# EasyEDA schematic Smart_Tiestu.json

## Sheets
1 Sheet_1: TITLE: Smart Tiestu; REV: 1.0; Date: 2025-11-10; Sheet: 1/1; Drawn By: Diego López; Company: Universidad de Oviedo
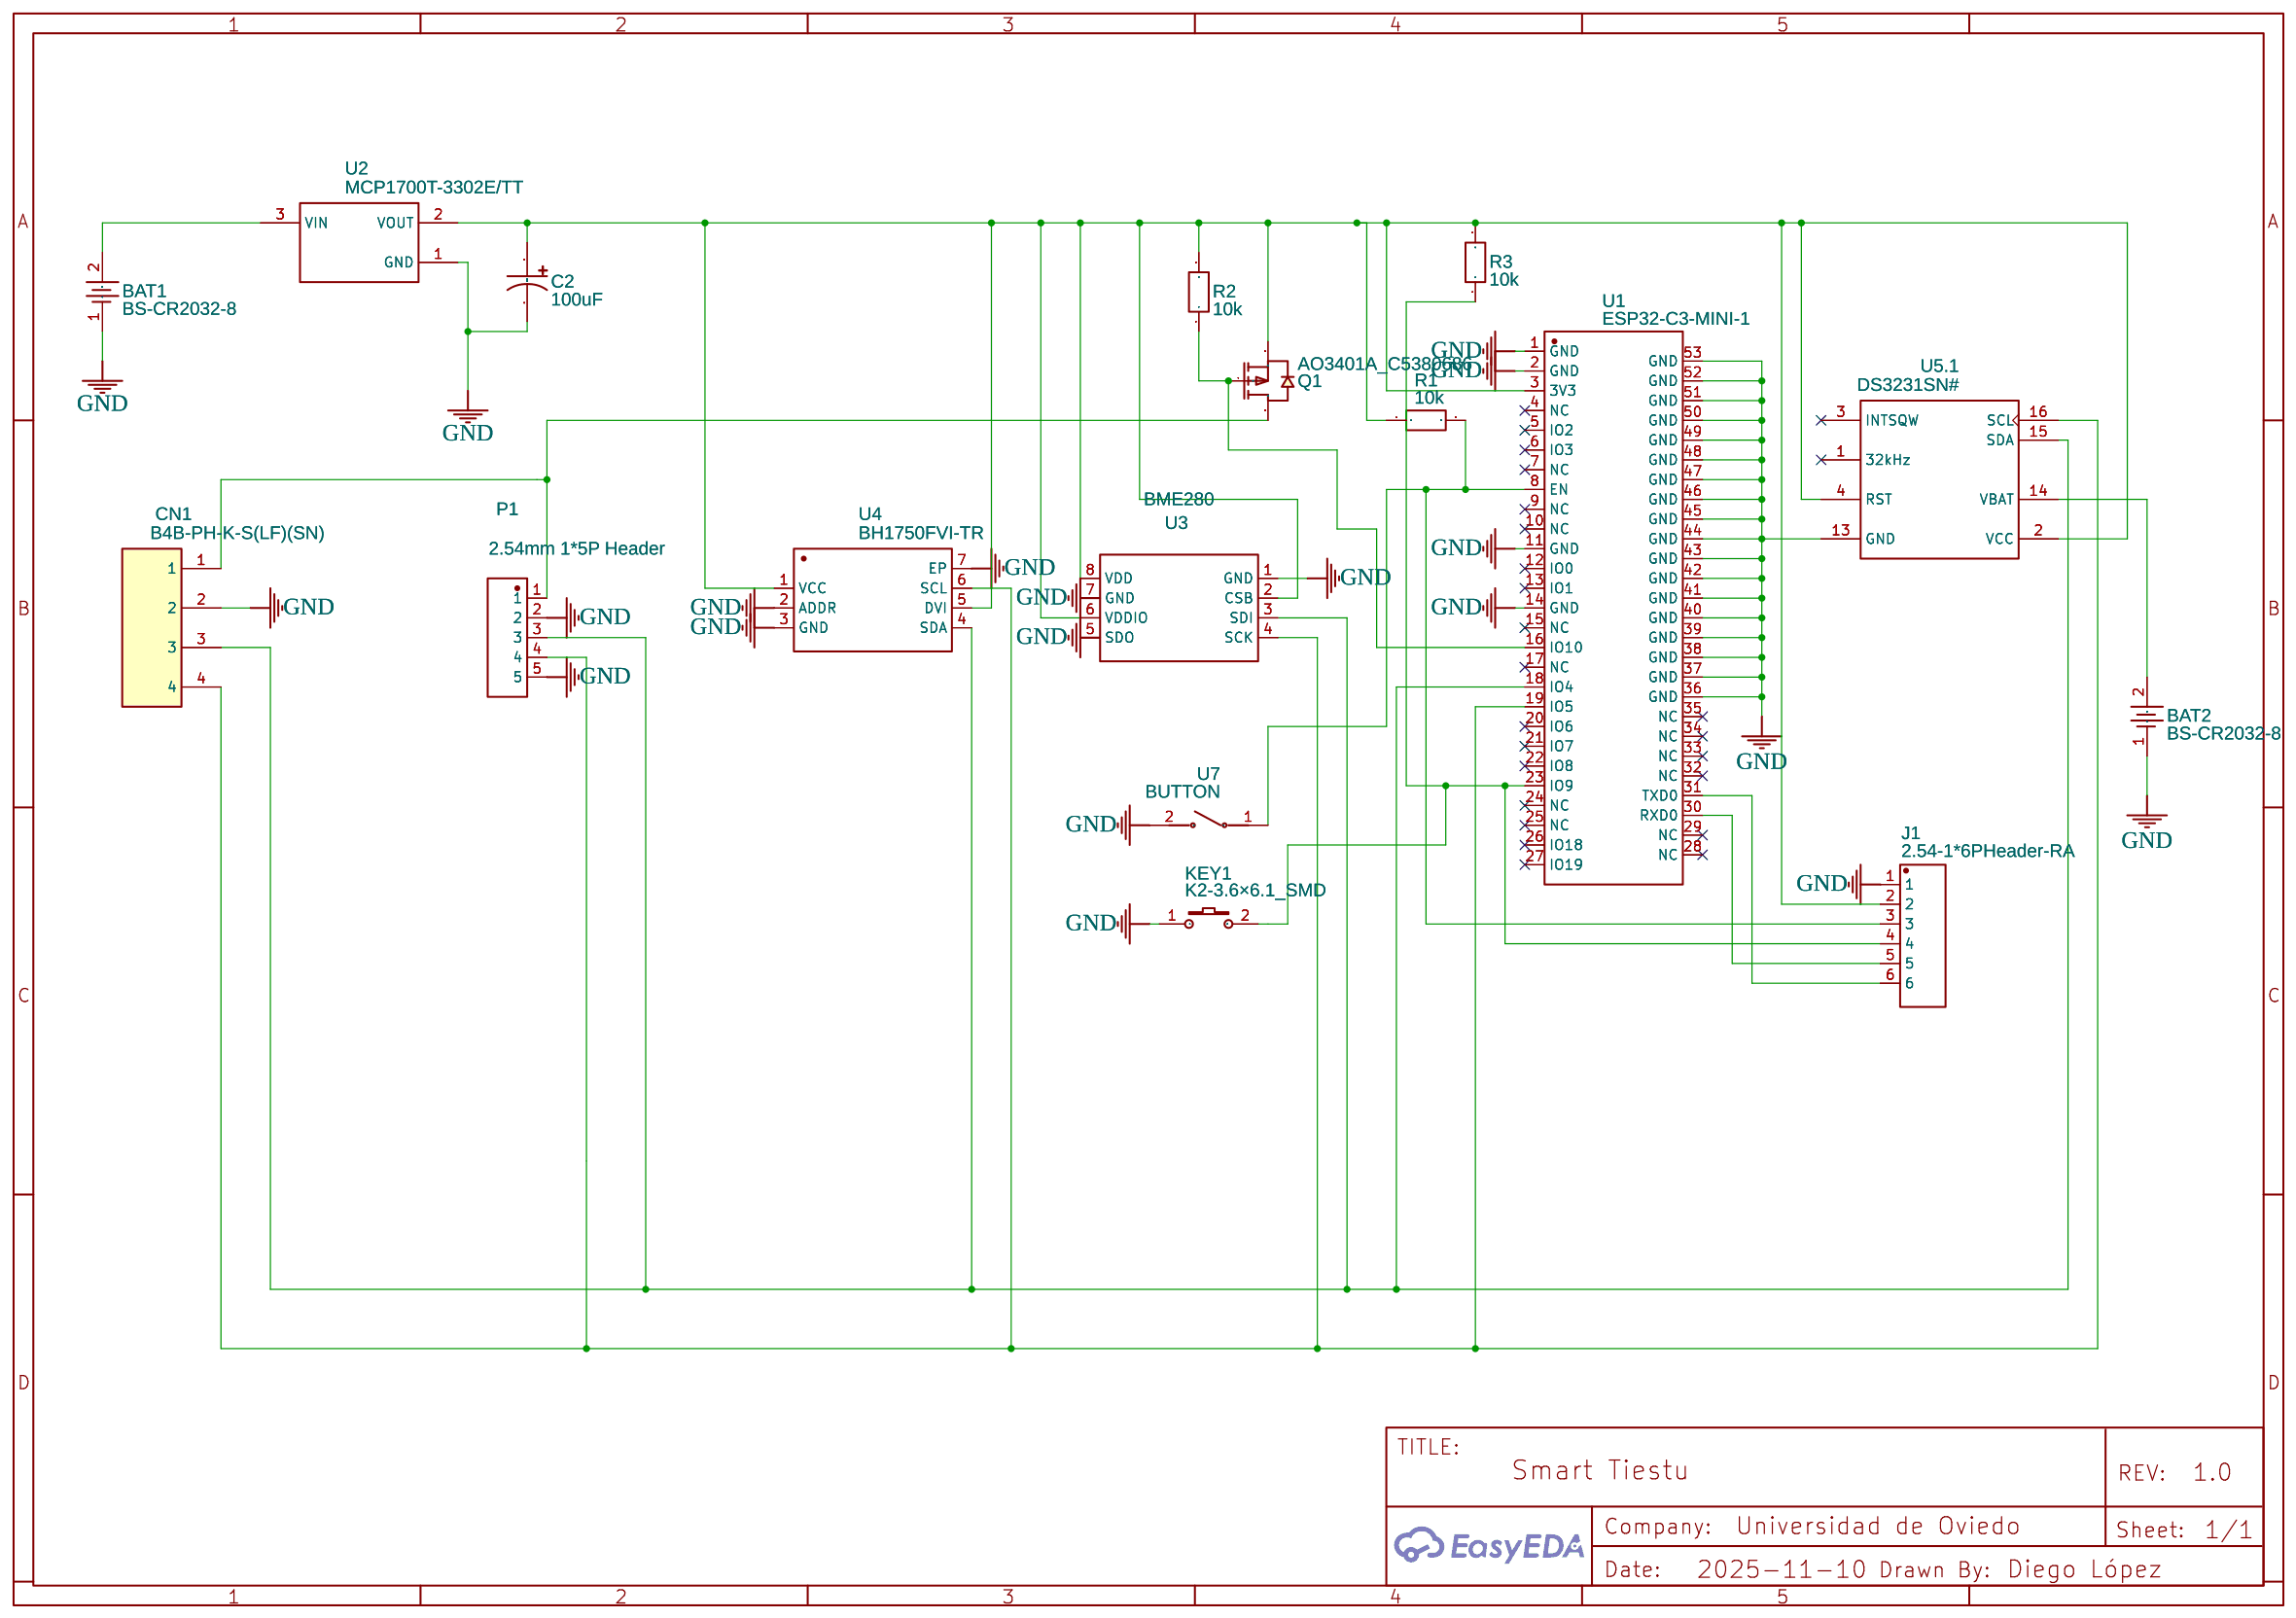
[diagram p0: Sheet_1]
2 Sheet_2: TITLE: Sheet_2; Date: 2025-11-13; Drawn By: lopeznoval; Company: Your Company
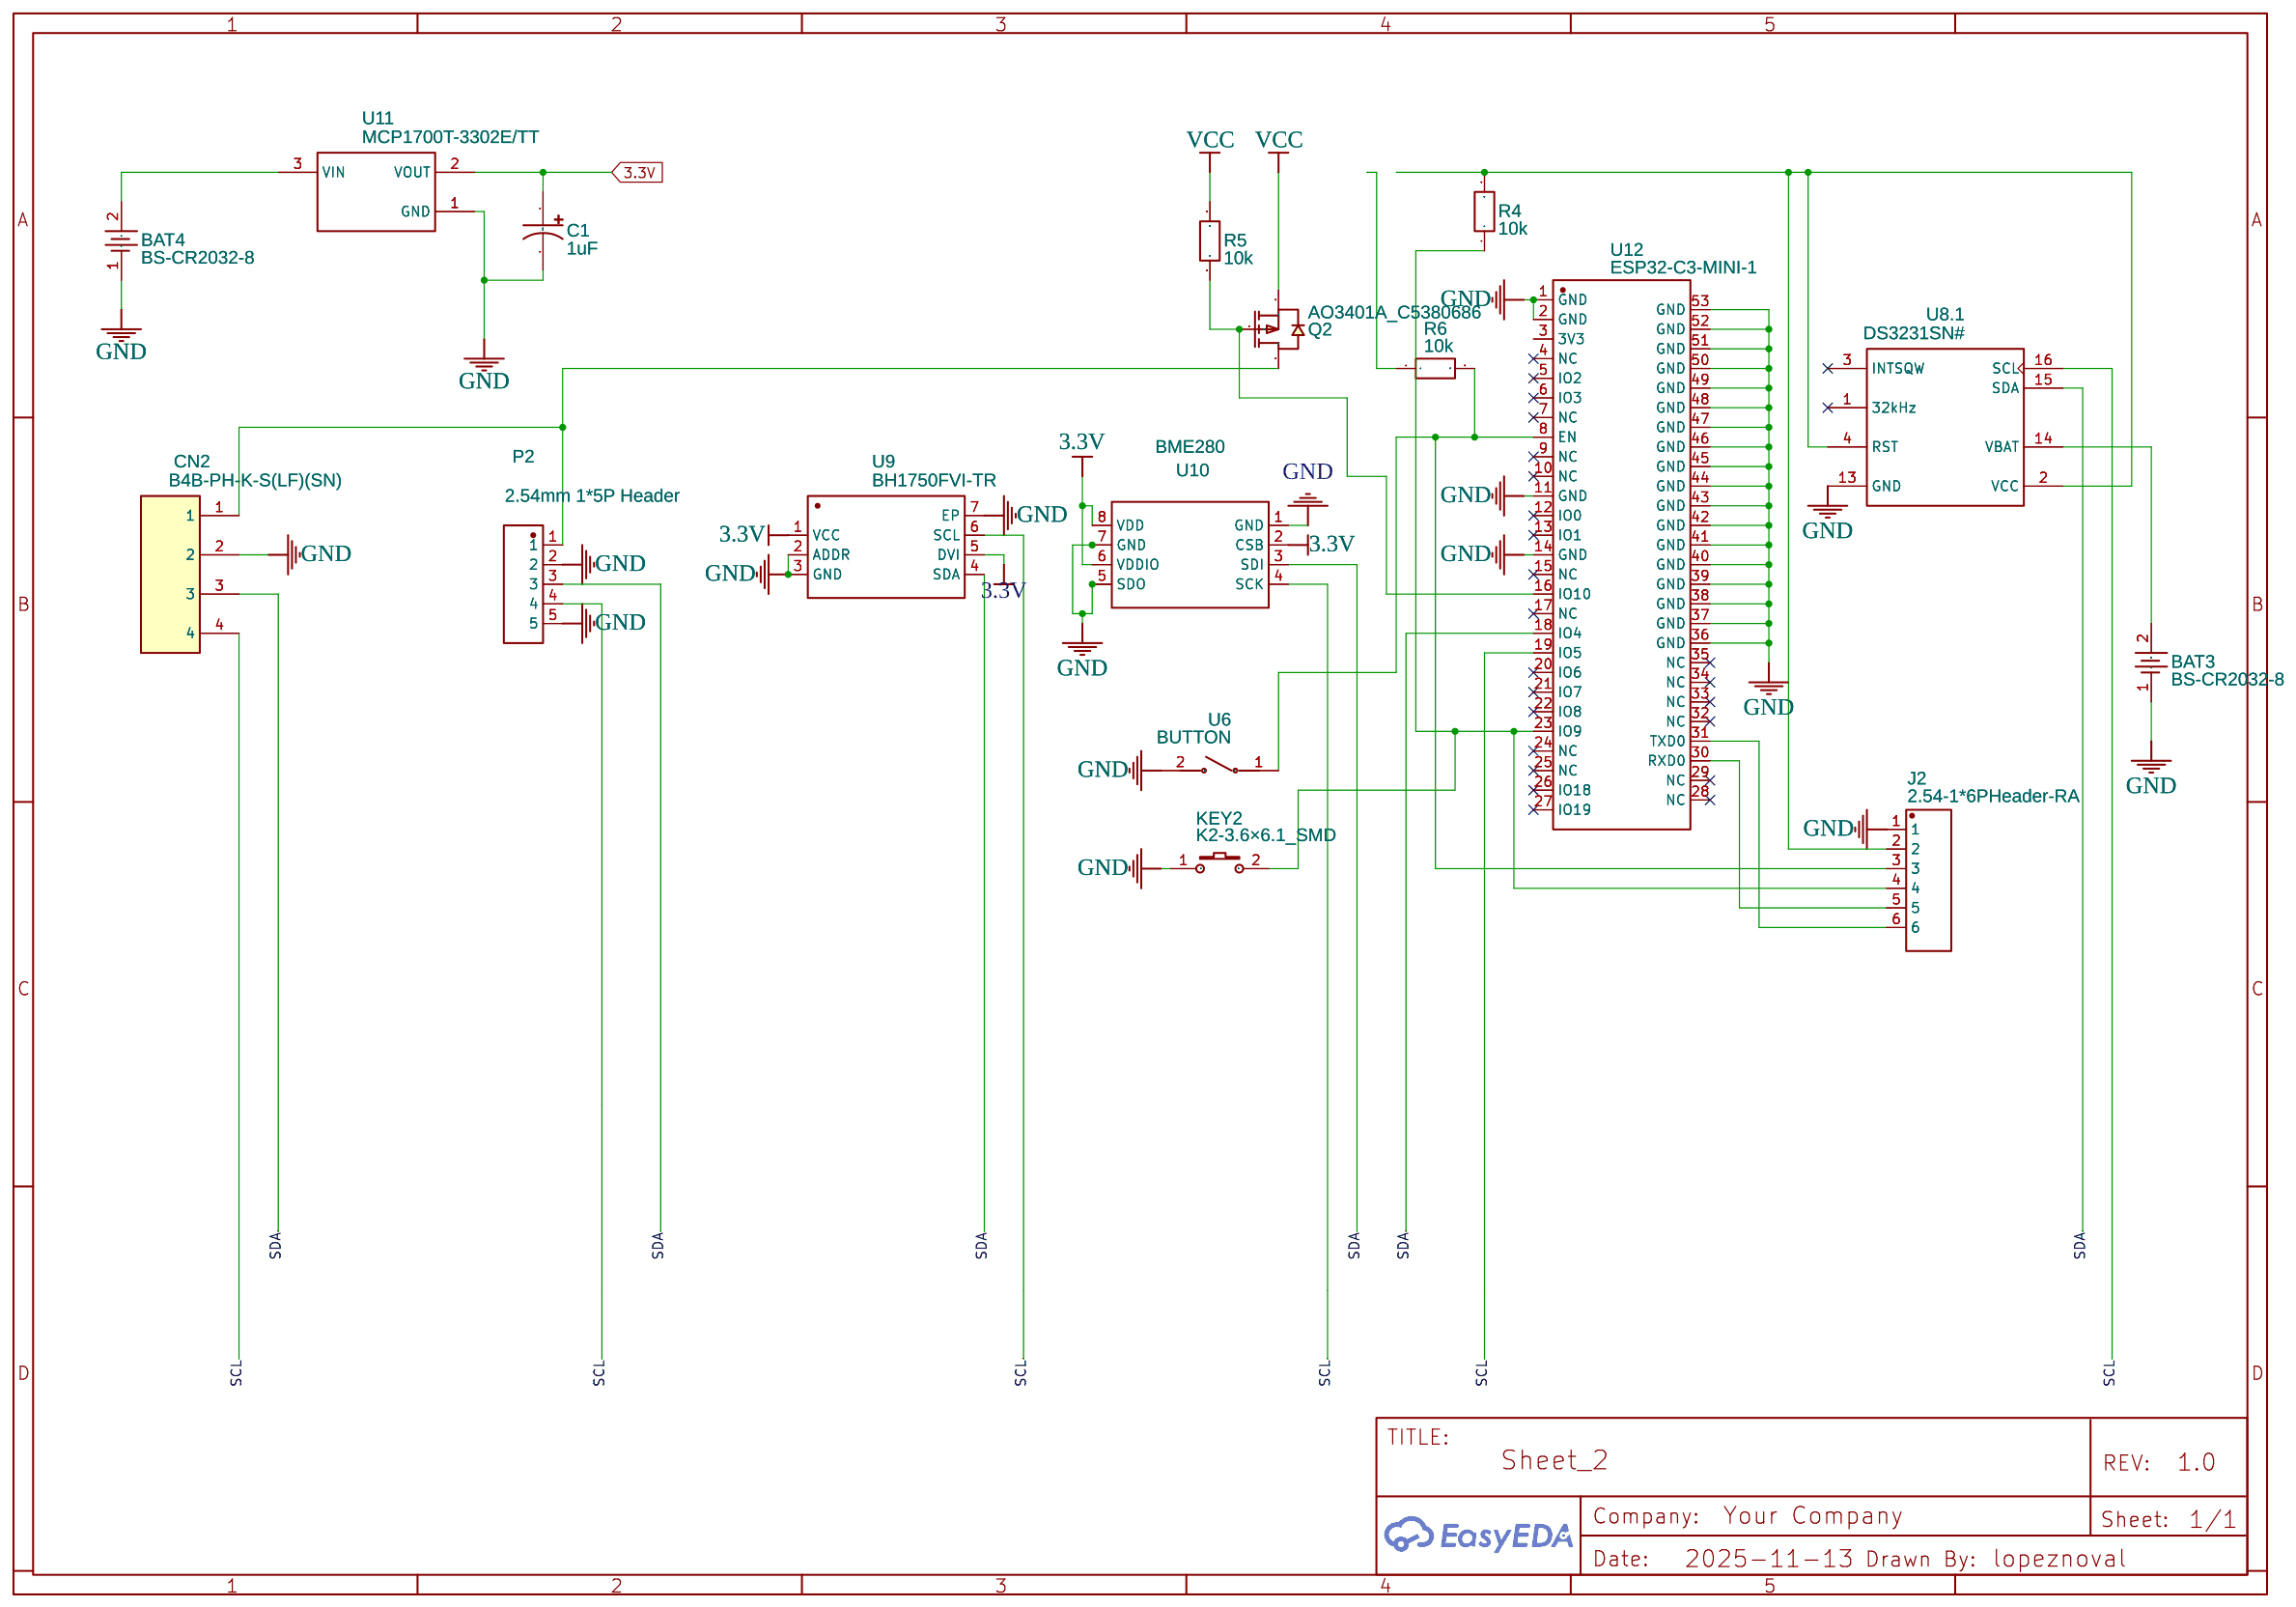
[diagram p1: Sheet_2]
3 Sheet_3: TITLE: Sheet_3; Date: 2025-11-17; Company: Your Company
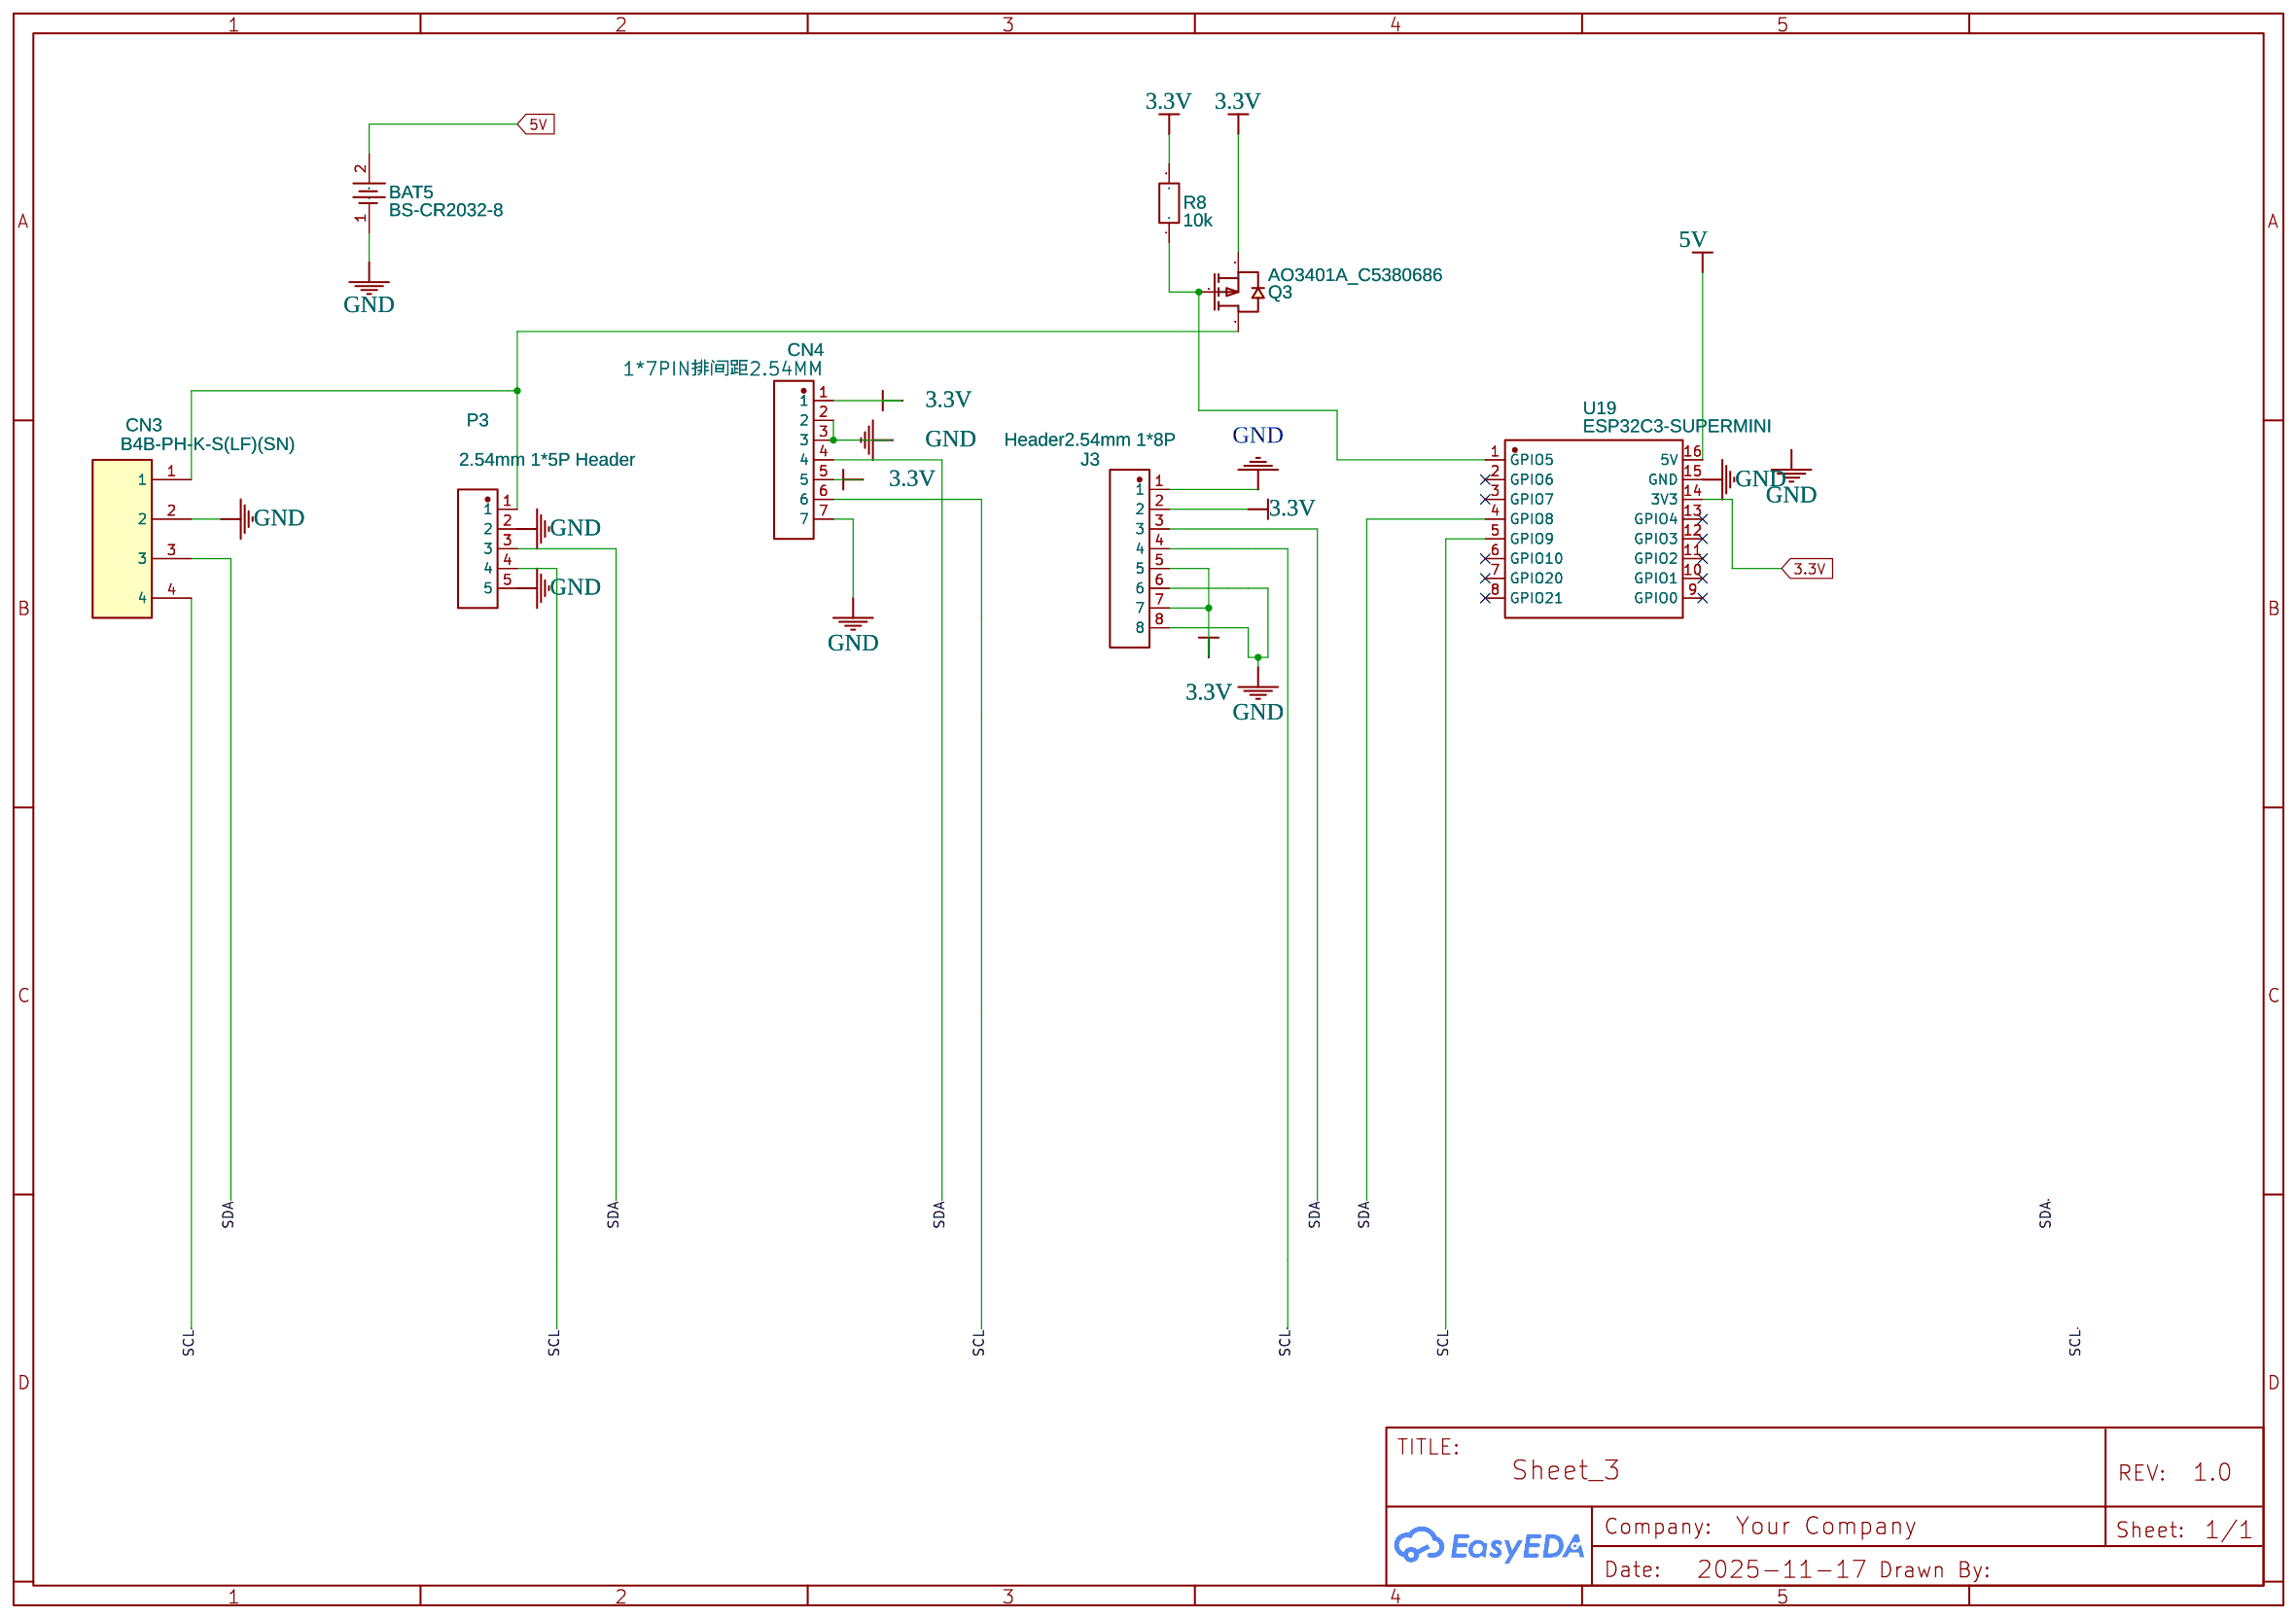
[diagram p2: Sheet_3]

## Parts
sheet Sheet_1
BAT1  BS-CR2032-8  [BAT-SMD_BS-CR2032-8]
BAT2  BS-CR2032-8  [BAT-SMD_BS-CR2032-8]
C2  100uF  [CAP-TH_BD6.3-P2.50-D0.5-FD]
CN1  B4B-PH-K-S(LF)(SN)  [CONN-TH_B4B-PH-K-S]
J1  2.54-1*6PHeader-RA  [HDR-TH_6P-P2.54-H-M-W10.0]
KEY1  K2-3.6×6.1_SMD  [KEY-SMD_2P-L6.2-W3.6-LS8.0]
P1  2.54mm 1*5P Header  [HDR-TH_5P-P2.54-V-M]
Q1  AO3401A_C5380686  [SOT-23-3_L2.9-W1.3-P1.90-LS2.4-BR]
R1  10k  [R0603]
R2  10k  [R0603]
R3  10k  [R0603]
U1  ESP32-C3-MINI-1  [WIFIM-SMD_ESP32-C3-MINI-1]
U2  MCP1700T-3302E/TT  [SOT-23-3_L2.9-W1.6-P1.90-LS2.8-BR]
U3  BME280  [LGA-8_BME280_BL]
U4  BH1750FVI-TR  [WSOF-6_L2.6-W1.6-P0.50-TL-EP]
U5  DS3231SN#  [SOIC-16_L10.3-W7.5-P1.27-LS10.3-BL]  (section 1)
U7  BUTTON  [SW-SMD_L3.9-W2.9-LS4.9-L]
sheet Sheet_2
BAT3  BS-CR2032-8  [BAT-SMD_BS-CR2032-8]
BAT4  BS-CR2032-8  [BAT-SMD_BS-CR2032-8]
C1  1uF  [CAP-TH_BD6.3-P2.50-D0.5-FD]
CN2  B4B-PH-K-S(LF)(SN)  [CONN-TH_B4B-PH-K-S]
J2  2.54-1*6PHeader-RA  [HDR-TH_6P-P2.54-H-M-W10.0]
KEY2  K2-3.6×6.1_SMD  [KEY-SMD_2P-L6.2-W3.6-LS8.0]
P2  2.54mm 1*5P Header  [HDR-TH_5P-P2.54-V-M]
Q2  AO3401A_C5380686  [SOT-23-3_L2.9-W1.3-P1.90-LS2.4-BR]
R4  10k  [R0603]
R5  10k  [R0603]
R6  10k  [R0603]
U6  BUTTON  [SW-SMD_L3.9-W2.9-LS4.9-L]
U8  DS3231SN#  [SOIC-16_L10.3-W7.5-P1.27-LS10.3-BL]  (section 1)
U9  BH1750FVI-TR  [WSOF-6_L2.6-W1.6-P0.50-TL-EP]
U10  BME280  [LGA-8_BME280_BL]
U11  MCP1700T-3302E/TT  [SOT-23-3_L2.9-W1.6-P1.90-LS2.8-BR]
U12  ESP32-C3-MINI-1  [WIFIM-SMD_ESP32-C3-MINI-1]
sheet Sheet_3
BAT5  BS-CR2032-8  [BAT-SMD_BS-CR2032-8]
CN3  B4B-PH-K-S(LF)(SN)  [CONN-TH_B4B-PH-K-S]
CN4  1*7PIN排间距2.54MM  [CONN-TH_7P-P2.54_C9900012194]
J3  Header2.54mm 1*8P  [HDR-TH_8P-P2.54-V-M]
P3  2.54mm 1*5P Header  [HDR-TH_5P-P2.54-V-M]
Q3  AO3401A_C5380686  [SOT-23-3_L2.9-W1.3-P1.90-LS2.4-BR]
R8  10k  [R0603]
U19  ESP32C3-SUPERMINI  [COMM-SMD_16P-L22.5-W18.0-P2.54-TL]

## Library data of the parts
BAT1-BAT5 = BS-CR2032-8: Supplier: LCSC; Supplier Part: C7498149; Manufacturer: LX(连欣科技); Contributor: lcsc; JLCPCB Part Class: Extended Part
C1 C2 = 25YXG100MLLCT16.3X11: Contributor: lcsc; Supplier: LCSC; Supplier Part: C2920634; Manufacturer: Rubycon(红宝石); JLCPCB Part Class: Extended Part
CN1-CN3 = B4B-PH-K-S(LF)(SN): Contributor: LCSC; Supplier: LCSC; Manufacturer: JST; Supplier Part: C131334; JLCPCB Part Class: Extended Part
J1 J2 = 2.54-1*6PHeader-RA: Supplier: LCSC; Manufacturer: BOOMELE(博穆精密); Manufacturer Part: 2.54-1*6P反弯排针; Supplier Part: C56816; JLCPCB Part Class: Extended Part
KEY1 KEY2 = K2-3.6×6.1_SMD: Supplier Part: C118141; Supplier: LCSC; Manufacturer Part: K2-1107ST-A4SW-06; Contributor: LCEDA_Lib; 制造商: 韩国韩荣
P1-P3 = 2.54mm 1*5P Header: Supplier Part: C50951; Supplier: LCSC; Manufacturer: ReliaPro
Q1-Q3 = AO3401A_C5380686: Contributor: lcsc; Supplier: LCSC; Supplier Part: C5380686; Manufacturer: FUXINSEMI(富芯森美); Manufacturer Part: AO3401A; JLCPCB Part Class: Extended Part
R1-R6 R8 = R_0603_EU: Contributor: LCEDA_Lib
U1 U12 = ESP32-C3-MINI-1: Contributor: lcsc; Supplier: LCSC; Supplier Part: C5290152; Manufacturer: RF Crazy(智汉); JLCPCB Part Class: Extended Part
U2 U11 = MCP1700T-3302E/TT: Supplier: LCSC; Manufacturer: MICROCHIP(美国微芯); Supplier Part: C39051; JLCPCB Part Class: Extended Part
U3 U10 = BME280: Contributor: LCSC; Supplier: LCSC; Manufacturer: Bosch(博世); Supplier Part: C92489; JLCPCB Part Class: Extended Part
U4 U9 = BH1750FVI-TR: Supplier: LCSC; Manufacturer: ROHM(罗姆); Supplier Part: C78960; JLCPCB Part Class: Extended Part
U5 U8 = DS3231SN#: tags: Clock; subpart_no: 1; image: http://image.lceda.cn/szlcsc/C9866.jpg; Supplier Part: C9866; Supplier: LCSC; Manufacturer: ADI(亚德诺)/MAXIM(美信); Manufacturer Part: DS3231SN#T&R; JLCPCB Part Class: Extended Part
U6 U7 = BUTTON: Contributor: lcsc; Supplier: LCSC; Supplier Part: C9900015607; Manufacturer: null; JLCPCB Part Class: Extended Part
CN4 = 1*7PIN排间距2.54MM: Contributor: LCSC; Supplier: LCSC; Supplier Part: C9900012194; Manufacturer: null; Manufacturer Part: 1*7pin排间距2.54mm; JLCPCB Part Class: Extended Part
J3 = Header2.54mm 1*8P: Supplier Part: C49256; Supplier: LCSC; Manufacturer: ReliaPro
U19 = ESP32C3-SUPERMINI: Supplier: LCSC; Supplier Part: C9900147397; Manufacturer: null; Manufacturer Part: ESP32C3-SuperMini; JLCPCB Part Class: Extended Part; Contributor: lcsc

## Nets
3.3V: C1.1 CN4.1 CN4.5 J3.2 J3.5 J3.7 Q3.2(S) R8.2 U9.1(VCC) U9.5(DVI) U10.2(CSB) U10.6(VDDIO) U10.8(VDD) U11.2(VOUT) U19.14(3V3)
5V: BAT5.2 U19.16(5V)
GND: BAT1.1 BAT2.1 BAT3.1 BAT4.1 BAT5.1 C1.2 C2.2 CN1.2 CN2.2 CN3.2 CN4.2 CN4.3 CN4.7 J1.1 J2.1 J3.1 J3.6 J3.8 KEY1.1 KEY2.1 P1.2 P1.5 P2.2 P2.5 P3.2 P3.5 U1.1(GND) U1.2(GND) U1.11(GND) U1.14(GND) U1.36(GND) U1.37(GND) U1.38(GND) U1.39(GND) U1.40(GND) U1.41(GND) U1.42(GND) U1.43(GND) U1.44(GND) U1.45(GND) U1.46(GND) U1.47(GND) U1.48(GND) U1.49(GND) U1.50(GND) U1.51(GND) U1.52(GND) U1.53(GND) U2.1(GND) U3.1(GND) U3.5(SDO) U3.7(GND) U4.2(ADDR) U4.3(GND) U4.7(EP) U5.13(GND) U6.2 U7.2 U8.13(GND) U9.2(ADDR) U9.3(GND) U9.7(EP) U10.1(GND) U10.5(SDO) U10.7(GND) U11.1(GND) U12.1(GND) U12.2(GND) U12.11(GND) U12.14(GND) U12.36(GND) U12.37(GND) U12.38(GND) U12.39(GND) U12.40(GND) U12.41(GND) U12.42(GND) U12.43(GND) U12.44(GND) U12.45(GND) U12.46(GND) U12.47(GND) U12.48(GND) U12.49(GND) U12.50(GND) U12.51(GND) U12.52(GND) U12.53(GND) U19.15(GND)
VCC: Q2.2(S) R5.2
SCL: CN2.4 CN3.4 CN4.6 J3.4 P2.4 P3.4 U8.16(SCL) U9.6(SCL) U10.4(SCK) U12.19(IO5) U19.5(GPIO9)
SDA: CN2.3 CN3.3 CN4.4 J3.3 P2.3 P3.3 U8.15(SDA) U9.4(SDA) U10.3(SDI) U12.18(IO4) U19.4(GPIO8)
Net-(BAT1-2): BAT1.2 U2.3(VIN)
Net-(BAT2-2): BAT2.2 U5.14(VBAT)
Net-(BAT3-2): BAT3.2 U8.14(VBAT)
Net-(BAT4-2): BAT4.2 U11.3(VIN)
Net-(C2-1): C2.1 J1.2 Q1.2(S) R1.1 R2.2 R3.2 U1.3(3V3) U2.2(VOUT) U3.2(CSB) U3.6(VDDIO) U3.8(VDD) U4.1(VCC) U4.5(DVI) U5.2(VCC) U5.4(RST)
Net-(CN1-1): CN1.1 P1.1 Q1.3(D)
Net-(CN1-3): CN1.3 P1.3 U1.18(IO4) U3.3(SDI) U4.4(SDA) U5.15(SDA)
Net-(CN1-4): CN1.4 P1.4 U1.19(IO5) U3.4(SCK) U4.6(SCL) U5.16(SCL)
Net-(CN2-1): CN2.1 P2.1 Q2.3(D)
Net-(CN3-1): CN3.1 P3.1 Q3.3(D)
Net-(J1-3): J1.3 R1.2 U1.8(EN) U7.1
Net-(J1-4): J1.4 KEY1.2 R3.1 U1.23(IO9)
Net-(J1-5): J1.5 U1.30(RXD0)
Net-(J1-6): J1.6 U1.31(TXD0)
Net-(J2-2): J2.2 R4.2 U8.2(VCC) U8.4(RST)
Net-(J2-3): J2.3 R6.2 U6.1 U12.8(EN)
Net-(J2-4): J2.4 KEY2.2 R4.1 U12.23(IO9)
Net-(J2-5): J2.5 U12.30(RXD0)
Net-(J2-6): J2.6 U12.31(TXD0)
Net-(Q1-1): Q1.1(G) R2.1 U1.16(IO10)
Net-(Q2-1): Q2.1(G) R5.1 U12.16(IO10)
Net-(Q3-1): Q3.1(G) R8.1 U19.1(GPIO5)

Not connected (* = marked no-connect by the designer): R6 1; U1 4(NC)* 5(IO2)* 6(IO3)* 7(NC)* 9(NC)* 10(NC)* 12(IO0)* 13(IO1)* 15(NC)* 17(NC)* 20(IO6)* 21(IO7)* 22(IO8)* 24(NC)* 25(NC)* 26(IO18)* 27(IO19)* 28(NC)* 29(NC)* 32(NC)* 33(NC)* 34(NC)* 35(NC)*; U5 1(32kHz)* 3(INTSQW)*; U8 1(32kHz)* 3(INTSQW)*; U12 3(3V3) 4(NC)* 5(IO2)* 6(IO3)* 7(NC)* 9(NC)* 10(NC)* 12(IO0)* 13(IO1)* 15(NC)* 17(NC)* 20(IO6)* 21(IO7)* 22(IO8)* 24(NC)* 25(NC)* 26(IO18)* 27(IO19)* 28(NC)* 29(NC)* 32(NC)* 33(NC)* 34(NC)* 35(NC)*; U19 2(GPIO6)* 3(GPIO7)* 6(GPIO10)* 7(GPIO20)* 8(GPIO21)* 9(GPIO0)* 10(GPIO1)* 11(GPIO2)* 12(GPIO3)* 13(GPIO4)*
